# Altium schematic sheet STM8S207R8T6 Header Board.SchDoc
size A
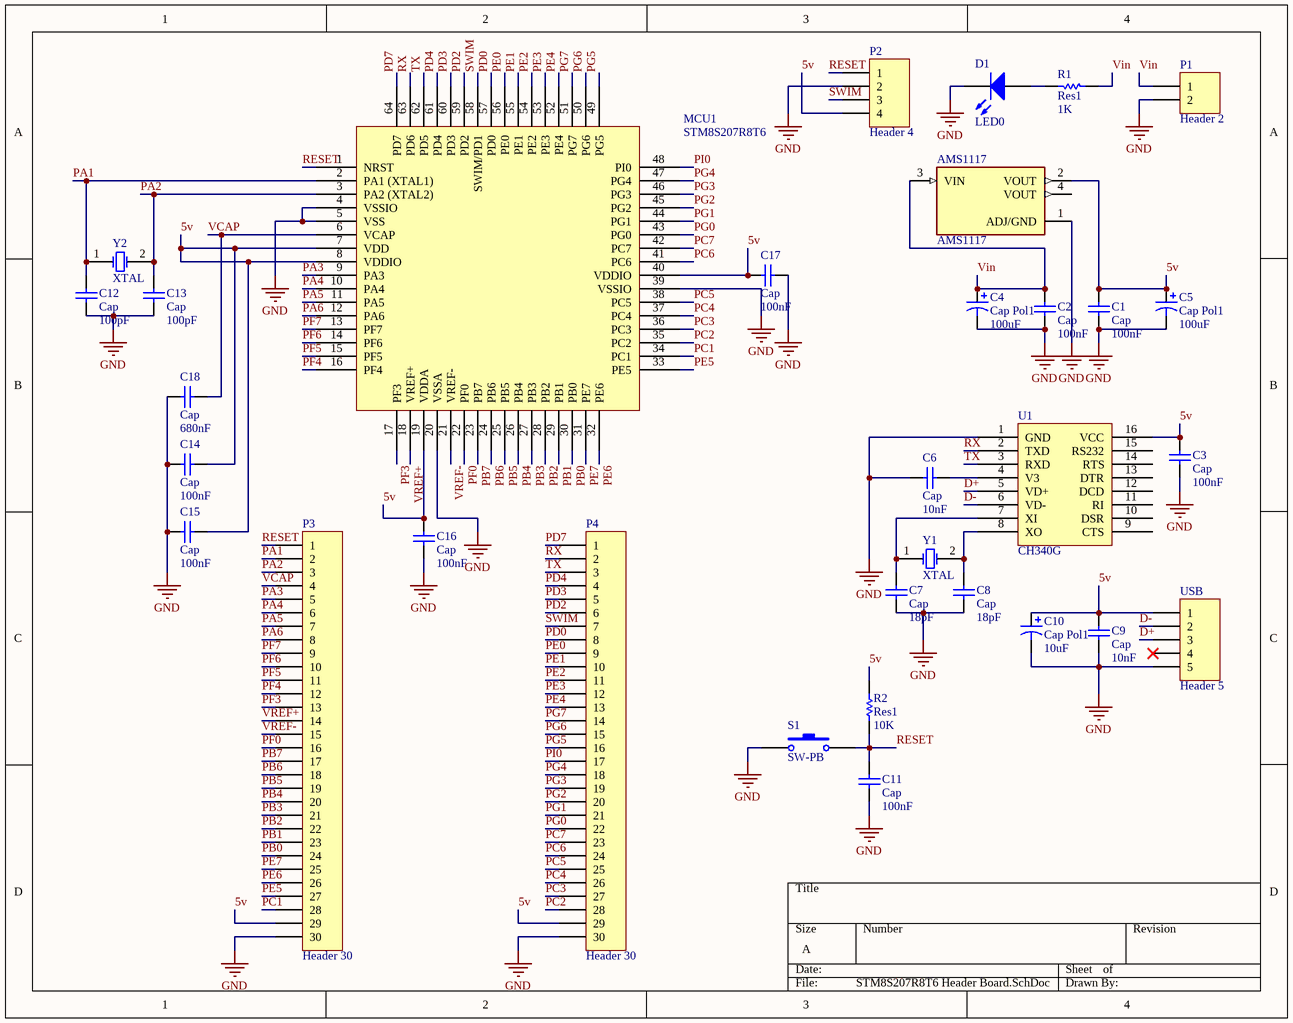
[diagram p0: STM8S207R8T6 Header Board.SchDoc]

## Parts
AMS1117  AMS1117  [SOT229P700X180-4N]
C1  Cap  value 100nF  [6-0805_N]
C2  Cap  value 100nF  [6-0805_N]
C3  Cap  value 100nF  [6-0805_N]
C4  Cap Pol1  value 100uF  [C1210_N]
C5  Cap Pol1  value 100uF  [C1210_N]
C6  Cap  value 10nF  [6-0805_N]
C7  Cap  value 18pF  [6-0805_N]
C8  Cap  value 18pF  [6-0805_N]
C9  Cap  value 10nF  [6-0805_N]
C10  Cap Pol1  value 10uF  [C1210_N]
C11  Cap  value 100nF  [6-0805_N]
C12  Cap  value 100pF  [6-0805_N]
C13  Cap  value 100pF  [6-0805_N]
C14  Cap  value 100nF  [6-0805_N]
C15  Cap  value 100nF  [6-0805_N]
C16  Cap  value 100nF  [6-0805_N]
C17  Cap  value 100nF  [6-0805_N]
C18  Cap  value 680nF  [6-0805_N]
D1  LED0  [6-0805_N]
MCU1  STM8S207R8T6  [QFP50P1200X1200X160-64N]
P1  Header 2  [Terminal2]
P2  Header 4  [HDR1X4]
P3  Header 30  [Header 30]
P4  Header 30  [Header 30]
R1  Res1  value 1K  [6-0805_N]
R2  Res1  value 10K  [6-0805_N]
S1  SW-PB  [RES_B]
U1  CH340G  [SOIC127P600X175-16N]
USB  Header 5  [TE_3-1734035-2]
Y1  XTAL  [Xtal]
Y2  XTAL  [Xtal]

## Nets
GND: AMS1117.1(ADJ/GND) C1.1 C2.1 C3.2 C4.2 C5.2 C6.1 C7.1 C8.1 C9.1 C10.2 C11.1 C12.1 C13.1 C14.2 C15.2 C16.1 C17.2 C18.2 D1.2(K) MCU1.4(VSSIO) MCU1.5(VSS) MCU1.20(VSSA) MCU1.39(VSSIO) P1.2 P2.2 P3.30 P4.30 S1.1 U1.1(GND) USB.5
5v: AMS1117.2(VOUT) C1.2 C3.1 C5.1 C9.2 C10.1 C14.1 C15.1 C16.2 C17.1 MCU1.7(VDD) MCU1.8(VDDIO) MCU1.19(VDDA) MCU1.40(VDDIO) P2.4 P3.29 P4.29 R2.2 U1.16(VCC) USB.1
D+: U1.5(VD+) USB.3
D-: U1.6(VD-) USB.2
PA1: C12.2 MCU1.2(PA1_(XTAL1)) P3.2 Y2.1(OSC1)
PA2: C13.2 MCU1.3(PA2_(XTAL2)) P3.3 Y2.2(OSC2)
PA3: MCU1.9(PA3) P3.5
PA4: MCU1.10(PA4) P3.6
PA5: MCU1.11(PA5) P3.7
PA6: MCU1.12(PA6) P3.8
PB0: MCU1.30(PB0) P3.24
PB1: MCU1.29(PB1) P3.23
PB2: MCU1.28(PB2) P3.22
PB3: MCU1.27(PB3) P3.21
PB4: MCU1.26(PB4) P3.20
PB5: MCU1.25(PB5) P3.19
PB6: MCU1.24(PB6) P3.18
PB7: MCU1.23(PB7) P3.17
PC1: MCU1.34(PC1) P3.28
PC2: MCU1.35(PC2) P4.28
PC3: MCU1.36(PC3) P4.27
PC4: MCU1.37(PC4) P4.26
PC5: MCU1.38(PC5) P4.25
PC6: MCU1.41(PC6) P4.24
PC7: MCU1.42(PC7) P4.23
PD0: MCU1.57(PD0) P4.8
PD2: MCU1.59(PD2) P4.6
PD3: MCU1.60(PD3) P4.5
PD4: MCU1.61(PD4) P4.4
PD7: MCU1.64(PD7) P4.1
PE0: MCU1.56(PE0) P4.9
PE1: MCU1.55(PE1) P4.10
PE2: MCU1.54(PE2) P4.11
PE3: MCU1.53(PE3) P4.12
PE4: MCU1.52(PE4) P4.13
PE5: MCU1.33(PE5) P3.27
PE6: MCU1.32(PE6) P3.26
PE7: MCU1.31(PE7) P3.25
PF0: MCU1.22(PF0) P3.16
PF3: MCU1.17(PF3) P3.13
PF4: MCU1.16(PF4) P3.12
PF5: MCU1.15(PF5) P3.11
PF6: MCU1.14(PF6) P3.10
PF7: MCU1.13(PF7) P3.9
PG0: MCU1.43(PG0) P4.22
PG1: MCU1.44(PG1) P4.21
PG2: MCU1.45(PG2) P4.20
PG3: MCU1.46(PG3) P4.19
PG4: MCU1.47(PG4) P4.18
PG5: MCU1.49(PG5) P4.16
PG6: MCU1.50(PG6) P4.15
PG7: MCU1.51(PG7) P4.14
PI0: MCU1.48(PI0) P4.17
RESET: C11.2 MCU1.1(NRST) P2.1 P3.1 R2.1 S1.2
RX: MCU1.63(PD6) P4.2 U1.2(TXD)
SWIM: MCU1.58(SWIM/PD1) P2.3 P4.7
TX: MCU1.62(PD5) P4.3 U1.3(RXD)
VCAP: C18.1 MCU1.6(VCAP) P3.4
Vin: AMS1117.3(VIN) C2.2 C4.1 P1.1 R1.1
VREF+: MCU1.18(VREF+) P3.14
VREF-: MCU1.21(VREF-) P3.15
NetC6_2: C6.2 U1.4(V3)
NetC7_2: C7.2 U1.7(XI) Y1.1(OSC1)
NetC8_2: C8.2 U1.8(XO) Y1.2(OSC2)
NetD1_1: D1.1(A) R1.2

Not connected (* = marked no-connect by the designer): AMS1117 4(VOUT); U1 9(CTS) 10(DSR) 11(RI) 12(DCD) 13(DTR) 14(RTS) 15(RS232); USB 4*

## Library data of the parts
AMS1117 = AMS1117: UNO PLUS Arduino R3 Shield, Xbee Arduino IDE Wheeled Robotics Kit; MF: Seeed Technology; Availability: Unavailable; SnapEDA_Link: https://www.snapeda.com/parts/AMS1117/Seeed%20Technology%20Co.%2C%20Ltd/view-part/184428/?ref=snap; MP: AMS1117; Price: None; Value: *; Package: SOT-223 Seeed Technology
C1-C3 C6-C9 C11-C18 = Cap: Capacitor; Published: 8-Jun-2000; LatestRevisionDate: 17-Jul-2002; LatestRevisionNote: Re-released for DXP Platform.; PackageReference: RAD-0.3; Publisher: Altium Limited; PackageDescription: Radial Cap, Thru-Hole; 2 Leads; 0.3 in Pin Spacing
C4 C5 C10 = Cap Pol1: Polarized Capacitor (Radial); Published: 8-Jun-2000; LatestRevisionDate: 17-Jul-2002; LatestRevisionNote: Re-released for DXP Platform.; PackageReference: RB7.6-15; Publisher: Altium Limited; PackageDescription: Polarized Capacitor (Radial); 2 Leads
D1 = LED0: Typical INFRARED GaAs LED; Published: 8-Jun-2000; LatestRevisionDate: 08-Jul-2005; LatestRevisionNote: Mech Layer 1 removed.; PackageReference: LED-0; Publisher: Altium Limited; PackageDescription: LED; 2 Leads
P1 = Header 2: Header, 2-Pin; LatestRevisionDate: 17-Jul-2002; LatestRevisionNote: Re-released for DXP Platform.; Publisher: Altium Limited
P2 = Header 4: Header, 4-Pin; LatestRevisionDate: 17-Jul-2002; LatestRevisionNote: Re-released for DXP Platform.; Publisher: Altium Limited
P3 P4 = Header 30: Header, 30-Pin; LatestRevisionDate: 17-Jul-2002; LatestRevisionNote: Re-released for DXP Platform.; Publisher: Altium Limited
R1 R2 = Res1: Resistor; Published: 8-Jun-2000; LatestRevisionDate: 17-Jul-2002; LatestRevisionNote: Re-released for DXP Platform.; PackageReference: AXIAL-0.3; Publisher: Altium Limited; PackageDescription: Axial Device, Thru-Hole; 2 Leads; 0.3 in Pin Spacing
S1 = SW-PB: Switch; Published: 24-Mar-1999; LatestRevisionDate: 17-Jul-2002; LatestRevisionNote: Re-released for DXP Platform.; PackageReference: SPST-2; Publisher: Altium Limited; PackageDescription: Switch; 2 Leads
USB = Header 5: Header, 5-Pin; LatestRevisionDate: 17-Jul-2002; LatestRevisionNote: Re-released for DXP Platform.; Publisher: Altium Limited
Y1 Y2 = XTAL: Crystal Oscillator; Published: 8-Jun-2000; LatestRevisionDate: 17-Jul-2002; LatestRevisionNote: Re-released for DXP Platform.; PackageReference: R38; Publisher: Altium Limited; PackageDescription: Crystal, Thru-Hole; 2 Leads; Body 3.1 x 8.2 mm (Dia.xH)